# Altium schematic sheet bt.SchDoc
size A4
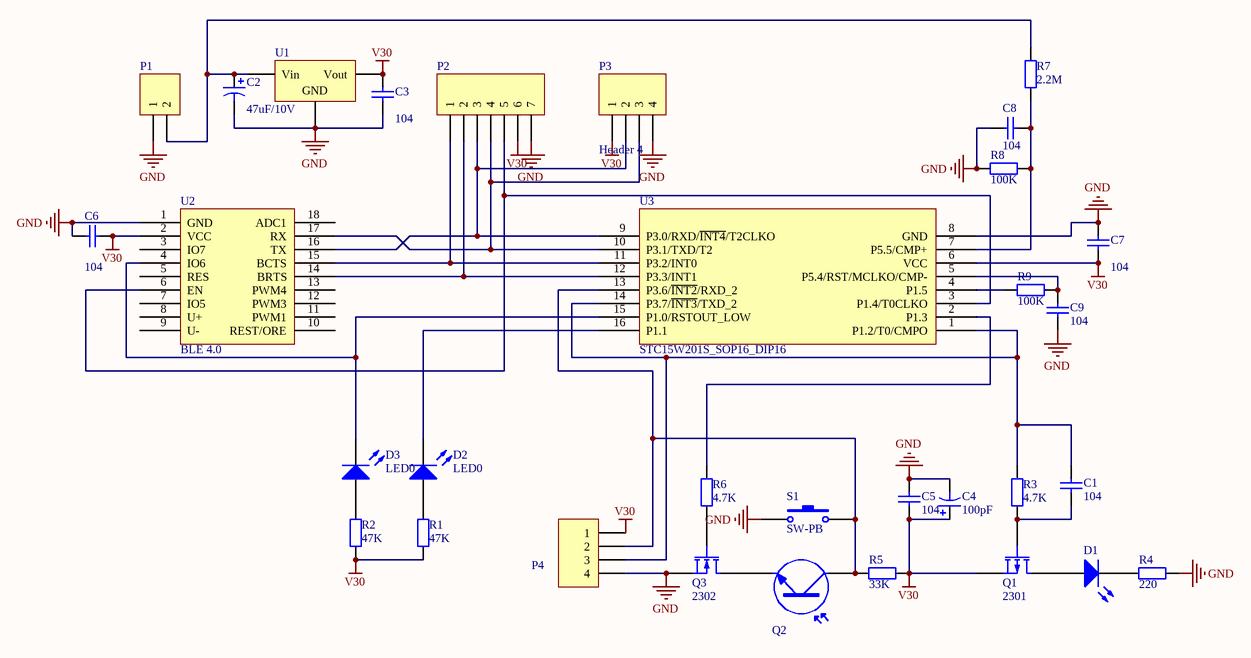
[diagram p0: bt.SchDoc]

## Parts
C1  47uF/10V: 104  [C0805]  (hidden comment: Cap Semi)
C2  value 47uF/10V  [3528]  (hidden comment: Cap Pol1)
C3  47uF/10V: 104  [C0805]  (hidden comment: Cap Semi)
C4  value 100pF  [3528]  (hidden comment: Cap Pol1)
C5  47uF/10V: 104  [C0805]  (hidden comment: Cap Semi)
C6  47uF/10V: 104  [C0805]  (hidden comment: Cap Semi)
C7  47uF/10V: 104  [C0805]  (hidden comment: Cap Semi)
C8  47uF/10V: 104  [C0805]  (hidden comment: Cap Semi)
C9  47uF/10V: 104  [C0805]  (hidden comment: Cap Semi)
D1  LED0  [LED1]  (value not drawn)
D2  LED0  [0805]
D3  LED0  [0805]
P1  Header 2  [HDR1X2]  (value not drawn)
P2  Header 7  [HDR1X7]  (value not drawn)
P3  Header 4  [HDR1X4]
P4  Header 4  [HDR1X4]  (value not drawn)
Q1  2301  [SOT-23 - LDO]
Q2  Photo NPN  [SIP3]  (value not drawn)
Q3  2302  [SOT-23 - LDO]
R1  value 47K  [C0805]  (hidden comment: Res2)
R2  value 47K  [C0805]  (hidden comment: Res2)
R3  value 4.7K  [C0805]  (hidden comment: Res2)
R4  value 220  [C0805]  (hidden comment: Res2)
R5  value 33K  [C0805]  (hidden comment: Res2)
R6  value 4.7K  [C0805]  (hidden comment: Res2)
R7  value 2.2M  [C0805]  (hidden comment: Res2)
R8  value 100K  [C0805]  (hidden comment: Res2)
R9  value 100K  [C0805]  (hidden comment: Res2)
S1  SW-PB  [KEY4]
U1  XC6206P302PR  [SOT-23 - LDO]  (value not drawn)
U2  BLE 4.0  [BLE4.0]
U3  STC15W201S_SOP16_DIP16  [SOP16]

## Nets
GND: C2.2 C3.1 C4.2 C5.1 C6.1 C7.2 C8.1 C9.2 P1.1 P2.7 P3.4 P4.4 Q3.2(S) R4.1 R8.2 S1.1 U1.1(GND) U2.1(GND) U3.8(GND)
V30: C3.2 C4.1 C5.2 C6.2 C7.1 P2.6 P3.1 P4.1 Q1.3(S) R1.1 R2.1 R5.1 U1.2(Vout) U2.2(VCC) U3.6(VCC)
NetC1_1: C1.1 P4.3 R3.2 U3.1(P1.2/T0/CMPO) U3.14(P3.7/~{INT3}/TXD_2)
NetC1_2: C1.2 Q1.1(G) R3.1
NetC2_1: C2.1 P1.2 R7.2 U1.3(Vin)
NetC8_2: C8.2 R7.1 R8.1 U3.7(P5.5/CMP+)
NetC9_1: C9.1 R9.1 U3.5(P5.4/RST/MCLKO/CMP-)
NetD1_1: D1.1(A) Q1.2(D)
NetD1_2: D1.2(K) R4.2
NetD2_1: D2.1(A) R1.2
NetD2_2: D2.2(K) U3.16(P1.1)
NetD3_1: D3.1(A) R2.2
NetD3_2: D3.2(K) U2.4(IO6) U3.15(P1.0/RSTOUT_LOW)
NetP2_1: P2.1 U2.15(BCTS) U3.11(P3.2/INT0)
NetP2_2: P2.2 U2.14(BRTS) U3.12(P3.3/INT1)
NetP2_3: P2.3 P3.2 U2.16(TX) U3.9(P3.0/RXD/~{INT4}/T2CLKO)
NetP2_4: P2.4 P3.3 U2.17(RX) U3.10(P3.1/TXD/T2)
NetP2_5: P2.5 U2.6(EN) U3.3(P1.4/T0CLKO)
NetP4_2: P4.2 Q2.1(C) R5.2 S1.3 U3.13(P3.6/~{INT2}/RXD_2)
NetQ2_2: Q2.2(E) Q3.3(D)
NetQ3_1: Q3.1(G) R6.1
NetR6_2: R6.2 U3.2(P1.3)
NetR9_2: R9.2 U3.4(P1.5)

Not connected (* = marked no-connect by the designer): U2 3(IO7) 5(RES) 7(IO5) 8(U+) 9(U-) 10(REST/ORE) 11(PWM1) 12(PWM3) 13(PWM4) 18(ADC1)

## Library data of the parts
C1 C3 C5-C9 = Cap Semi: Capacitor (Semiconductor SIM Model); Published: 8-Jun-2000; LatestRevisionDate: 29-May-2009; LatestRevisionNote: IPC-7351 Footprint Added.; PackageReference: C1206; Publisher: Altium Limited; PackageDescription: Chip Capacitor
C2 C4 = Cap Pol1: Polarized Capacitor (Radial); Published: 8-Jun-2000; LatestRevisionDate: 17-Jul-2002; LatestRevisionNote: Re-released for DXP Platform.; PackageReference: RB7.6-15; Publisher: Altium Limited; PackageDescription: Polarized Capacitor (Radial); 2 Leads
D1-D3 = LED0: Typical INFRARED GaAs LED; Published: 8-Jun-2000; LatestRevisionDate: 08-Jul-2005; LatestRevisionNote: Mech Layer 1 removed.; PackageReference: LED-0; Publisher: Altium Limited; PackageDescription: LED; 2 Leads
P1 = Header 2: Header, 2-Pin; LatestRevisionDate: 17-Jul-2002; LatestRevisionNote: Re-released for DXP Platform.; Publisher: Altium Limited
P2 = Header 7: Header, 7-Pin; LatestRevisionDate: 17-Jul-2002; LatestRevisionNote: Re-released for DXP Platform.; Publisher: Altium Limited
P3 P4 = Header 4: Header, 4-Pin; LatestRevisionDate: 17-Jul-2002; LatestRevisionNote: Re-released for DXP Platform.; Publisher: Altium Limited
Q1 = MOSFET-P: P-Channel MOSFET; Published: 8-Jun-2000; LatestRevisionDate: 17-Jul-2002; LatestRevisionNote: Re-released for DXP Platform.; PackageVersion: 1995/1996; PackageReference: E3; Publisher: Altium Limited; PackageDescription: TO, Flat Index; 3 In-Line, Axial Leads; Body Dia. 4.6mm; Lead Dia. 0.5 mm (max)
Q2 = Photo NPN: NPN Phototransistor; Published: 24-Mar-1999; LatestRevisionDate: 17-Jul-2002; LatestRevisionNote: Re-released for DXP Platform.; PackageReference: TO-220_A; Publisher: Altium Limited; Code_JEDEC: TO-220-AC
Q3 = MOSFET-N: N-Channel MOSFET; Published: 8-Jun-2000; LatestRevisionDate: 17-Jul-2002; LatestRevisionNote: Re-released for DXP Platform.; PackageVersion: 1995/1996; PackageReference: E3; Publisher: Altium Limited; PackageDescription: TO, Flat Index; 3 In-Line, Axial Leads; Body Dia. 4.6mm; Lead Dia. 0.5 mm (max)
R1-R9 = Res2: Resistor; Published: 8-Jun-2000; LatestRevisionDate: 17-Jul-2002; LatestRevisionNote: Re-released for DXP Platform.; PackageReference: AXIAL-0.4; Publisher: Altium Limited; PackageDescription: Axial Device, Thru-Hole; 2 Leads; 0.4 in Pin Spacing
S1 = SW-PB: Switch; Published: 24-Mar-1999; LatestRevisionDate: 17-Jul-2002; LatestRevisionNote: Re-released for DXP Platform.; PackageReference: SPST-2; Publisher: Altium Limited; PackageDescription: Switch; 2 Leads
U1 = Volt Reg: Voltage Regulator; Published: 24-Mar-1999; LatestRevisionDate: 29-May-2009; LatestRevisionNote: IPC-7351 Footprint Added.; PackageReference: D2PAK; Publisher: Altium Limited; PackageDescription: 3-Pin Transistor Outline Package 2.54 mm Pitch, 15.1 mm Lead Span